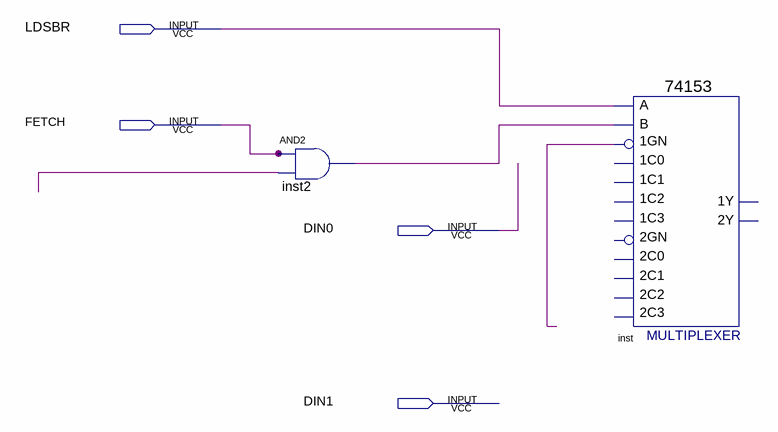
[diagram p0: schematic sheet]
// Quartus schematic lab02.bdf as structural Verilog: 2 symbols, 4 pins
module lab02 (
  input  LDSBR,
  input  FETCH,
  input  DIN0,
  input  DIN1
);

  wire inst2_out, undriven, undriven_2;

  and inst2 (inst2_out, FETCH, undriven);
  \74153  inst (
    .\1GN (undriven_2), .B(inst2_out), .A(LDSBR));  // open: 1C1, 1C0, 2C0, 2GN, 2C2, 1C2, 1C3, 2C1, 2C3, 1Y, 2Y
endmodule
